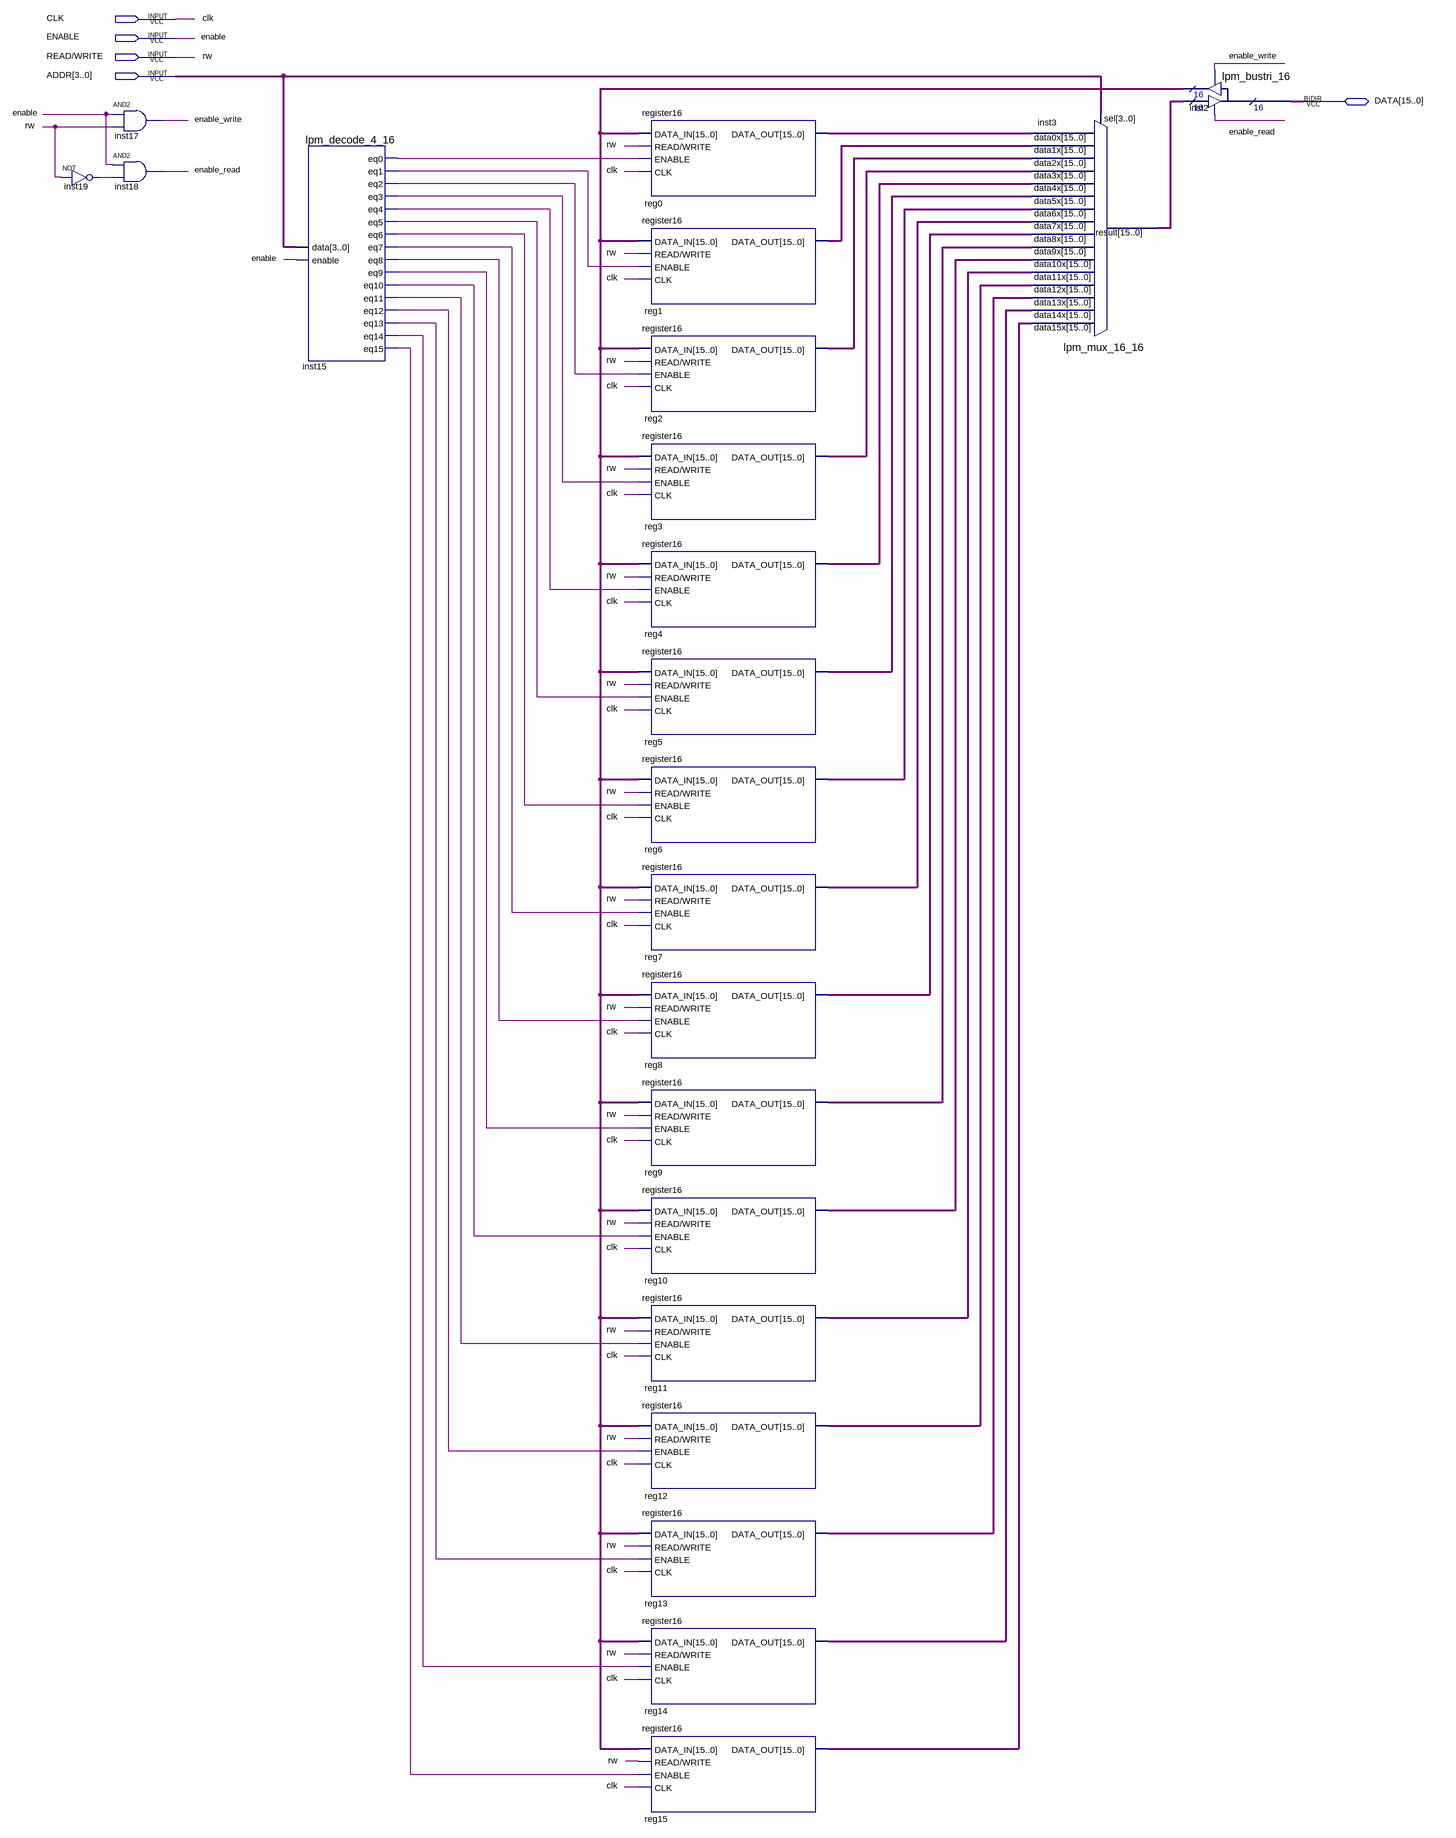
[diagram p0: schematic sheet]
// Quartus schematic register16_block16.bdf as structural Verilog: 22 symbols, 5 pins
module register16_block16 (
  input  CLK,
  input  ENABLE,
  input  \READ/WRITE ,
  input  [3:0] ADDR,
  inout  [15:0] DATA
);

  wire enable_read, enable_write, inst15_eq0, inst15_eq1, inst15_eq2, inst15_eq3, inst15_eq4, inst15_eq5,
       inst15_eq6, inst15_eq7, inst15_eq8, inst15_eq9, inst15_eq10, inst15_eq11, inst15_eq12, inst15_eq13,
       inst15_eq14, inst15_eq15, inst19_out;
  wire [15:0] inst2_result, inst3_result, reg0_data_out, reg1_data_out, reg2_data_out, reg3_data_out,
       reg4_data_out, reg5_data_out, reg6_data_out, reg7_data_out, reg8_data_out, reg9_data_out,
       reg10_data_out, reg11_data_out, reg12_data_out, reg13_data_out, reg14_data_out, reg15_data_out;

  not inst19 (inst19_out, \READ/WRITE );
  and inst17 (enable_write, ENABLE, \READ/WRITE );
  and inst18 (enable_read, ENABLE, inst19_out);
  lpm_decode_4_16 inst15 (
    .data(ADDR), .enable(ENABLE), .eq0(inst15_eq0), .eq1(inst15_eq1), .eq2(inst15_eq2), .eq3(inst15_eq3),
    .eq4(inst15_eq4), .eq5(inst15_eq5), .eq6(inst15_eq6), .eq7(inst15_eq7), .eq8(inst15_eq8),
    .eq9(inst15_eq9), .eq10(inst15_eq10), .eq11(inst15_eq11), .eq12(inst15_eq12), .eq13(inst15_eq13),
    .eq14(inst15_eq14), .eq15(inst15_eq15));
  register16 reg0 (
    .DATA_IN(inst2_result), .\READ/WRITE (\READ/WRITE ), .ENABLE(inst15_eq0), .CLK(CLK),
    .DATA_OUT(reg0_data_out));
  register16 reg1 (
    .DATA_IN(inst2_result), .\READ/WRITE (\READ/WRITE ), .ENABLE(inst15_eq1), .CLK(CLK),
    .DATA_OUT(reg1_data_out));
  register16 reg2 (
    .DATA_IN(inst2_result), .\READ/WRITE (\READ/WRITE ), .ENABLE(inst15_eq2), .CLK(CLK),
    .DATA_OUT(reg2_data_out));
  register16 reg3 (
    .DATA_IN(inst2_result), .\READ/WRITE (\READ/WRITE ), .ENABLE(inst15_eq3), .CLK(CLK),
    .DATA_OUT(reg3_data_out));
  register16 reg4 (
    .DATA_IN(inst2_result), .\READ/WRITE (\READ/WRITE ), .ENABLE(inst15_eq4), .CLK(CLK),
    .DATA_OUT(reg4_data_out));
  register16 reg5 (
    .DATA_IN(inst2_result), .\READ/WRITE (\READ/WRITE ), .ENABLE(inst15_eq5), .CLK(CLK),
    .DATA_OUT(reg5_data_out));
  register16 reg6 (
    .DATA_IN(inst2_result), .\READ/WRITE (\READ/WRITE ), .ENABLE(inst15_eq6), .CLK(CLK),
    .DATA_OUT(reg6_data_out));
  register16 reg7 (
    .DATA_IN(inst2_result), .\READ/WRITE (\READ/WRITE ), .ENABLE(inst15_eq7), .CLK(CLK),
    .DATA_OUT(reg7_data_out));
  register16 reg8 (
    .DATA_IN(inst2_result), .\READ/WRITE (\READ/WRITE ), .ENABLE(inst15_eq8), .CLK(CLK),
    .DATA_OUT(reg8_data_out));
  register16 reg9 (
    .DATA_IN(inst2_result), .\READ/WRITE (\READ/WRITE ), .ENABLE(inst15_eq9), .CLK(CLK),
    .DATA_OUT(reg9_data_out));
  register16 reg10 (
    .DATA_IN(inst2_result), .\READ/WRITE (\READ/WRITE ), .ENABLE(inst15_eq10), .CLK(CLK),
    .DATA_OUT(reg10_data_out));
  register16 reg11 (
    .DATA_IN(inst2_result), .\READ/WRITE (\READ/WRITE ), .ENABLE(inst15_eq11), .CLK(CLK),
    .DATA_OUT(reg11_data_out));
  register16 reg12 (
    .DATA_IN(inst2_result), .\READ/WRITE (\READ/WRITE ), .ENABLE(inst15_eq12), .CLK(CLK),
    .DATA_OUT(reg12_data_out));
  register16 reg13 (
    .DATA_IN(inst2_result), .\READ/WRITE (\READ/WRITE ), .ENABLE(inst15_eq13), .CLK(CLK),
    .DATA_OUT(reg13_data_out));
  register16 reg14 (
    .DATA_IN(inst2_result), .\READ/WRITE (\READ/WRITE ), .ENABLE(inst15_eq14), .CLK(CLK),
    .DATA_OUT(reg14_data_out));
  register16 reg15 (
    .DATA_IN(inst2_result), .\READ/WRITE (\READ/WRITE ), .ENABLE(inst15_eq15), .CLK(CLK),
    .DATA_OUT(reg15_data_out));
  lpm_mux_16_16 inst3 (
    .data15x(reg15_data_out), .data14x(reg14_data_out), .data13x(reg13_data_out), .data12x(reg12_data_out),
    .data11x(reg11_data_out), .data10x(reg10_data_out), .data9x(reg9_data_out), .data8x(reg8_data_out),
    .data7x(reg7_data_out), .data6x(reg6_data_out), .data5x(reg5_data_out), .data4x(reg4_data_out),
    .data3x(reg3_data_out), .data2x(reg2_data_out), .data1x(reg1_data_out), .data0x(reg0_data_out),
    .sel(ADDR), .result(inst3_result));
  lpm_bustri_16 inst2 (
    .enabledt(enable_read), .data(inst3_result), .enabletr(enable_write), .result(inst2_result),
    .tridata(DATA));

  // Other names for the same wires on the sheet: rw = \READ/WRITE 
endmodule
